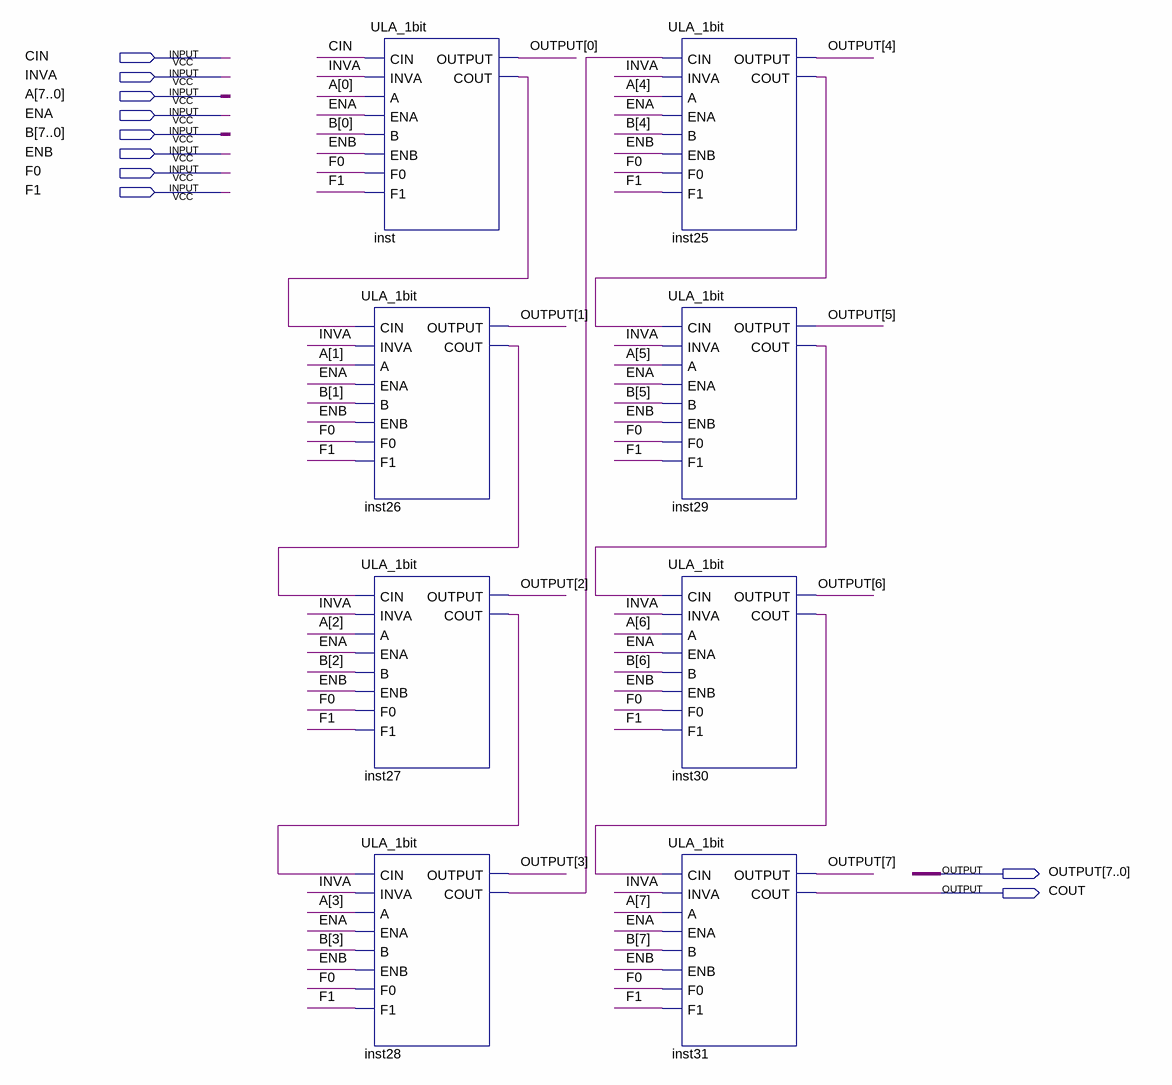
[diagram p0: schematic sheet]
// Quartus schematic ULA_8bit.bdf as structural Verilog: 8 symbols, 10 pins
module ULA_8bit (
  input  CIN,
  input  INVA,
  input  [7:0] A,
  input  ENA,
  input  [7:0] B,
  input  ENB,
  input  F0,
  input  F1,
  output [7:0] OUTPUT,
  output COUT
);

  wire inst25_cout, inst26_cout, inst27_cout, inst28_cout, inst29_cout, inst30_cout, inst_cout;

  ULA_1bit inst (
    .CIN(CIN), .INVA(INVA), .A(A[0]), .ENA(ENA), .B(B[0]), .ENB(ENB), .F0(F0), .F1(F1), .OUTPUT(OUTPUT[0]),
    .COUT(inst_cout));
  ULA_1bit inst26 (
    .CIN(inst_cout), .INVA(INVA), .A(A[1]), .ENA(ENA), .B(B[1]), .ENB(ENB), .F0(F0), .F1(F1),
    .OUTPUT(OUTPUT[1]), .COUT(inst26_cout));
  ULA_1bit inst27 (
    .CIN(inst26_cout), .INVA(INVA), .A(A[2]), .ENA(ENA), .B(B[2]), .ENB(ENB), .F0(F0), .F1(F1),
    .OUTPUT(OUTPUT[2]), .COUT(inst27_cout));
  ULA_1bit inst28 (
    .CIN(inst27_cout), .INVA(INVA), .A(A[3]), .ENA(ENA), .B(B[3]), .ENB(ENB), .F0(F0), .F1(F1),
    .OUTPUT(OUTPUT[3]), .COUT(inst28_cout));
  ULA_1bit inst25 (
    .CIN(inst28_cout), .INVA(INVA), .A(A[4]), .ENA(ENA), .B(B[4]), .ENB(ENB), .F0(F0), .F1(F1),
    .OUTPUT(OUTPUT[4]), .COUT(inst25_cout));
  ULA_1bit inst29 (
    .CIN(inst25_cout), .INVA(INVA), .A(A[5]), .ENA(ENA), .B(B[5]), .ENB(ENB), .F0(F0), .F1(F1),
    .OUTPUT(OUTPUT[5]), .COUT(inst29_cout));
  ULA_1bit inst30 (
    .CIN(inst29_cout), .INVA(INVA), .A(A[6]), .ENA(ENA), .B(B[6]), .ENB(ENB), .F0(F0), .F1(F1),
    .OUTPUT(OUTPUT[6]), .COUT(inst30_cout));
  ULA_1bit inst31 (
    .CIN(inst30_cout), .INVA(INVA), .A(A[7]), .ENA(ENA), .B(B[7]), .ENB(ENB), .F0(F0), .F1(F1),
    .OUTPUT(OUTPUT[7]), .COUT(COUT));
endmodule
